# Altium schematic sheet Oscilador.SchDoc
size A
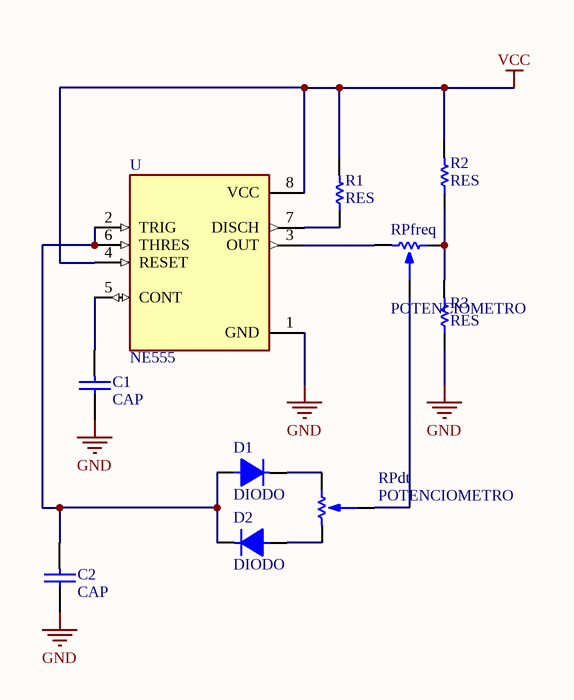
[diagram p0: Oscilador.SchDoc]

## Parts
C1  CAP  [CAP200]
C2  CAP  [CAP200]
D1  DIODO  [DO41]
D2  DIODO  [DO41]
R1  RES  [RES400]
R2  RES  [RES400]
R3  RES  [RES400]
RPdt  POTENCIOMETRO  [POTENCIOMETRO]
RPfreq  POTENCIOMETRO  [POTENCIOMETRO]
U  NE555  [DIP794W45P254L1060H508Q8]

## Nets
GND: C1.2 C2.2 R3.1 U.1(GND)
VCC: R1.2 R2.2 U.4(RESET) U.8(VCC)
NetC1_1: C1.1 U.5(CONT)
NetC2_1: C2.1 D1.1 D2.2 U.2(TRIG) U.6(THRES)
NetD1_2: D1.2 RPdt.1
NetD2_1: D2.1 RPdt.3
NetR1_1: R1.1 U.7(DISCH)
NetR2_1: R2.1 R3.2 RPfreq.1
NetRPdt_2: RPdt.2 RPfreq.2
NetRPfreq_3: RPfreq.3 U.3(OUT)

## Library data of the parts
U = NE555: 555 Type, Timer/Oscillator _Single_ IC 100kHz 8-SOIC; MF: Texas Instruments; Package: SOIC-8 Conrad; Availability: Unavailable; MP: NE555; Value: *; SnapEDA_Link: https://www.snapeda.com/parts/NE555/Texas%20Instruments/view-part/1756807/?ref=snap; Price: None